# Altium schematic sheet MCU_Display.SchDoc: Microcontroller and OLED display
size A4; Date: Not used; ApprovedBy: Not used; CheckedBy: Not used; Author: Not used; CompanyName: STMicroelectronics; DrawnBy: Not used; Engineer: Not used; Organization: Not used; Address1: Not used; Address2: Not used; Address3: Not used; Address4: Not used; DocumentNumber: Not used; Revision: Not used; SheetNumber: 3; SheetTotal: 8; CurrentTime: Not used; CurrentDate: Not used; Time: Not used; DocumentFullPathAndName: Not used; DocumentName: Not used; ModifiedDate: Not used; ImagePath: Not used; ProjectName: Not used; Application_BuildNumber: Not used
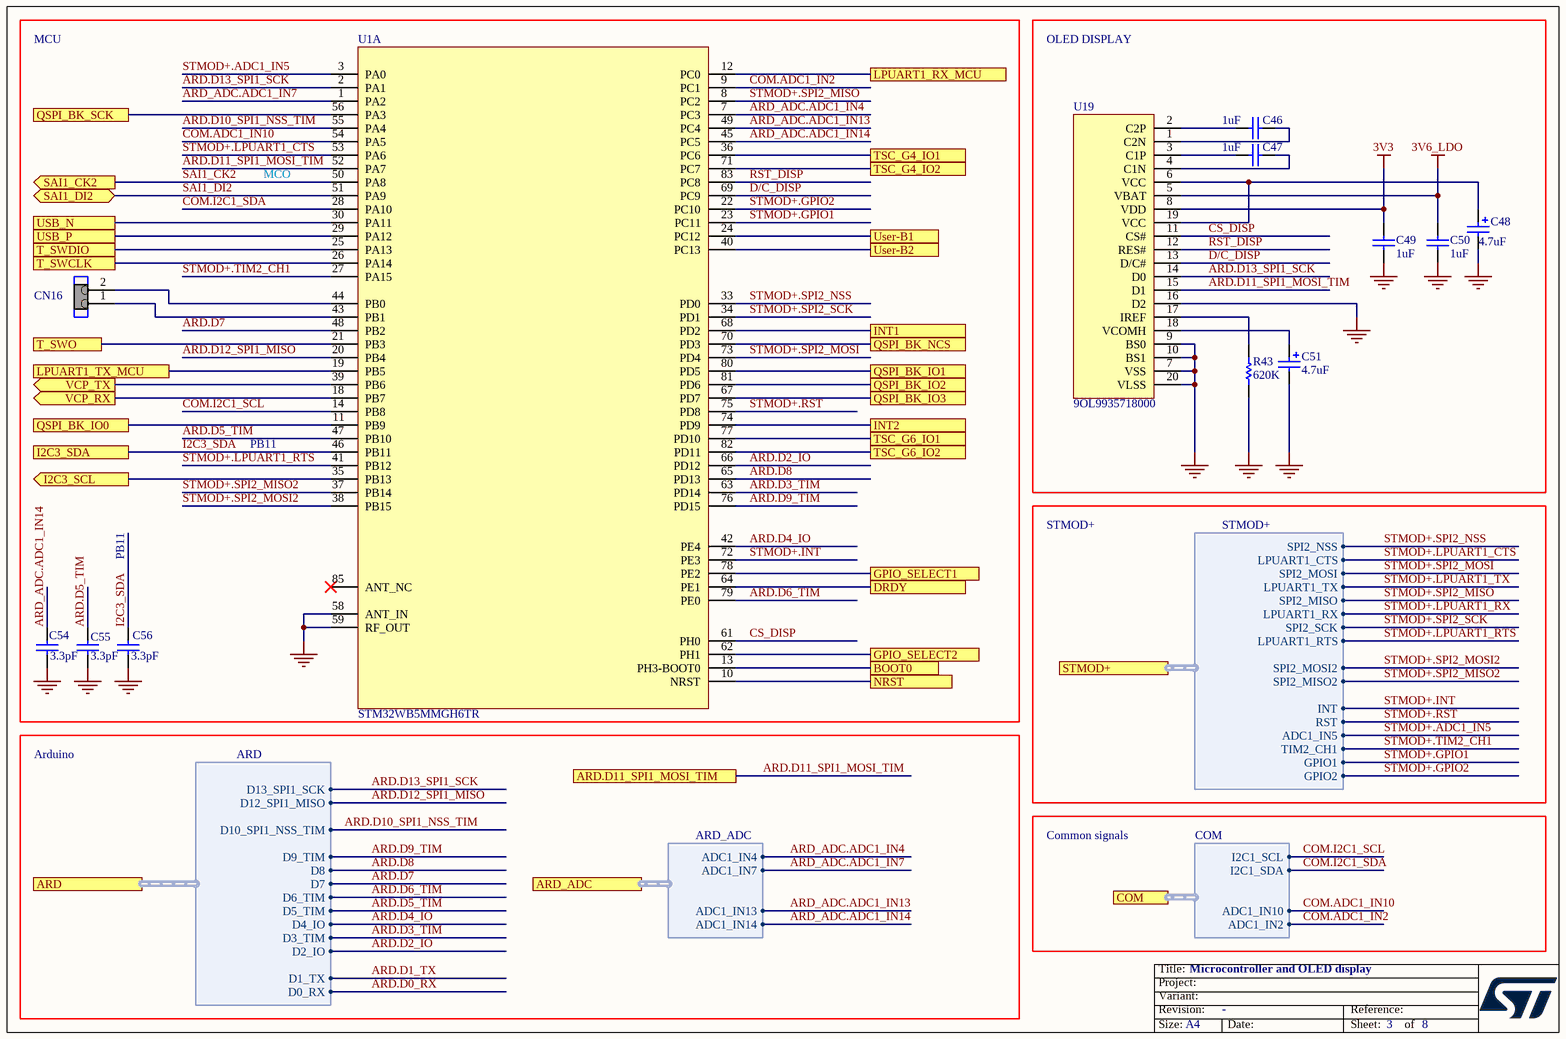
[diagram p0: MCU_Display.SchDoc]

## Parts
C46  value 1uF  [C0603]  (hidden comment: Capacitor)
C47  value 1uF  [C0603]  (hidden comment: Capacitor)
C48  value 4.7uF  [CPOL_TAJ-A_1206_H180]  (hidden comment: Cap_POL_TANA)
C49  value 1uF  [C0603]  (hidden comment: Capacitor)
C50  value 1uF  [C0603]  (hidden comment: Capacitor)
C51  value 4.7uF  [CPOL_TAJ-A_1206_H180]  (hidden comment: Cap_POL_TANA)
C54  value 3.3pF  [C0201_H0P3]  (hidden comment: Capacitor)
C55  value 3.3pF  [C0201_H0P3]  (hidden comment: Capacitor)
C56  value 3.3pF  [C0201_H0P3]  (hidden comment: Capacitor)
CN16  Jumper_Header1.27 2x1 Fitted  [CON_WP_707-2-02-2-20-00]  (value not drawn)
R43  value 620K  [R0603]  (hidden comment: Resistor)
U1  STM32WB5MMGH6TR  [MOD_DORY_STM_86P_7P3X11_H1P342]  (part A of 2)
U19  value 9OL9935718000  [OLED_RITDISPLAY_9OL9935718000]  (hidden comment: OLED_RITDISPLAY_9OL9935718000)

## Blocks framed on the sheet
OLED DISPLAY: C46-C51 R43 U19

## Ports
ARD (harness ARD), ARD.D11_SPI1_MOSI_TIM, ARD_ADC (harness ARD_ADC), BOOT0, COM (harness COM), DRDY, GPIO_SELECT1, GPIO_SELECT2, I2C3_SCL (out), I2C3_SDA, INT1, INT2, LPUART1_RX_MCU, LPUART1_TX_MCU, NRST, QSPI_BK_IO0, QSPI_BK_IO1, QSPI_BK_IO2, QSPI_BK_IO3, QSPI_BK_NCS, QSPI_BK_SCK, SAI1_CK2 (out), SAI1_DI2 (bidir), STMOD+ (harness STMOD+), T_SWCLK, T_SWDIO, T_SWO, TSC_G4_IO1, TSC_G4_IO2, TSC_G6_IO1, TSC_G6_IO2, USB_N, USB_P, User-B1, User-B2, VCP_RX (out), VCP_TX (out)

## Harnesses
STMOD+: SPI2_NSS, LPUART1_CTS, SPI2_MOSI, LPUART1_TX, SPI2_MISO, SPI2_SCK, LPUART1_RX, LPUART1_RTS, SPI2_MOSI2, SPI2_MISO2, INT, RST, ADC1_IN5, TIM2_CH1, GPIO1, GPIO2
ARD: D0_RX, D1_TX, D2_IO, D3_TIM, D4_IO, D5_TIM, D6_TIM, D7, D8, D9_TIM, D10_SPI1_NSS_TIM, D12_SPI1_MISO, D13_SPI1_SCK
ARD_ADC: ADC1_IN4, ADC1_IN7, ADC1_IN13, ADC1_IN14
COM: I2C1_SCL, I2C1_SDA, ADC1_IN10, ADC1_IN2

## Nets
3V3: C49.1 U19.8(VDD)
3V6_LDO: C50.1 U19.5(VBAT)
GND: C48.2 C49.2 C50.2 C51.2 C54.2 C55.1 C56.1 R43.1 U1.58(ANT_IN) U1.59(RF_OUT) U19.7(VSS) U19.9(BS0) U19.10(BS1) U19.16(D2) U19.20(VLSS)
ARD.D0_RX: port ARD.D0_RX
ARD.D1_TX: port ARD.D1_TX
ARD.D2_IO: U1.66(PD12) ; port ARD.D2_IO
ARD.D3_TIM: U1.63(PD14) ; port ARD.D3_TIM
ARD.D4_IO: U1.42(PE4) ; port ARD.D4_IO
ARD.D5_TIM: C55.2 U1.47(PB10) ; port ARD.D5_TIM
ARD.D6_TIM: U1.79(PE0) ; port ARD.D6_TIM
ARD.D7: U1.48(PB2) ; port ARD.D7
ARD.D8: U1.65(PD13) ; port ARD.D8
ARD.D9_TIM: U1.76(PD15) ; port ARD.D9_TIM
ARD.D10_SPI1_NSS_TIM: U1.55(PA4) ; port ARD.D10_SPI1_NSS_TIM
ARD.D11_SPI1_MOSI_TIM: U1.52(PA7) U19.15(D1) ; port ARD.D11_SPI1_MOSI_TIM
ARD.D12_SPI1_MISO: U1.20(PB4) ; port ARD.D12_SPI1_MISO
ARD.D13_SPI1_SCK: U1.2(PA1) U19.14(D0) ; port ARD.D13_SPI1_SCK
ARD_ADC.ADC1_IN4: U1.7(PC3) ; port ARD_ADC.ADC1_IN4
ARD_ADC.ADC1_IN7: U1.1(PA2) ; port ARD_ADC.ADC1_IN7
ARD_ADC.ADC1_IN13: U1.49(PC4) ; port ARD_ADC.ADC1_IN13
ARD_ADC.ADC1_IN14: C54.1 U1.45(PC5) ; port ARD_ADC.ADC1_IN14
BOOT0: U1.13(PH3-BOOT0) ; port BOOT0
COM.ADC1_IN2: U1.9(PC1) ; port COM.ADC1_IN2
COM.ADC1_IN10: U1.54(PA5) ; port COM.ADC1_IN10
COM.I2C1_SCL: U1.14(PB8) ; port COM.I2C1_SCL
COM.I2C1_SDA: U1.28(PA10) ; port COM.I2C1_SDA
CS_DISP: U1.61(PH0) U19.11(CS#)
D/C_DISP: U1.69(PC9) U19.13(D/C#)
DRDY: U1.64(PE1) ; port DRDY
GPIO_SELECT1: U1.78(PE2) ; port GPIO_SELECT1
GPIO_SELECT2: U1.62(PH1) ; port GPIO_SELECT2
I2C3_SCL: U1.35(PB13) ; port I2C3_SCL
I2C3_SDA: C56.2 U1.46(PB11) ; port I2C3_SDA
INT1: U1.68(PD2) ; port INT1
INT2: U1.74(PD9) ; port INT2
LPUART1_RX_MCU: U1.12(PC0) ; port LPUART1_RX_MCU
LPUART1_TX_MCU: U1.19(PB5) ; port LPUART1_TX_MCU
NRST: U1.10(NRST) ; port NRST
QSPI_BK_IO0: U1.11(PB9) ; port QSPI_BK_IO0
QSPI_BK_IO1: U1.80(PD5) ; port QSPI_BK_IO1
QSPI_BK_IO2: U1.81(PD6) ; port QSPI_BK_IO2
QSPI_BK_IO3: U1.67(PD7) ; port QSPI_BK_IO3
QSPI_BK_NCS: U1.70(PD3) ; port QSPI_BK_NCS
QSPI_BK_SCK: U1.56(PA3) ; port QSPI_BK_SCK
RST_DISP: U1.83(PC8) U19.12(RES#)
SAI1_CK2: U1.50(PA8) ; port SAI1_CK2
SAI1_DI2: U1.51(PA9) ; port SAI1_DI2
STMOD+.ADC1_IN5: U1.3(PA0) ; port STMOD+.ADC1_IN5
STMOD+.GPIO1: U1.23(PC11) ; port STMOD+.GPIO1
STMOD+.GPIO2: U1.22(PC10) ; port STMOD+.GPIO2
STMOD+.INT: U1.72(PE3) ; port STMOD+.INT
STMOD+.LPUART1_CTS: U1.53(PA6) ; port STMOD+.LPUART1_CTS
STMOD+.LPUART1_RTS: U1.41(PB12) ; port STMOD+.LPUART1_RTS
STMOD+.LPUART1_RX: port STMOD+.LPUART1_RX
STMOD+.LPUART1_TX: port STMOD+.LPUART1_TX
STMOD+.RST: U1.75(PD8) ; port STMOD+.RST
STMOD+.SPI2_MISO: U1.8(PC2) ; port STMOD+.SPI2_MISO
STMOD+.SPI2_MISO2: U1.37(PB14) ; port STMOD+.SPI2_MISO2
STMOD+.SPI2_MOSI: U1.73(PD4) ; port STMOD+.SPI2_MOSI
STMOD+.SPI2_MOSI2: U1.38(PB15) ; port STMOD+.SPI2_MOSI2
STMOD+.SPI2_NSS: U1.33(PD0) ; port STMOD+.SPI2_NSS
STMOD+.SPI2_SCK: U1.34(PD1) ; port STMOD+.SPI2_SCK
STMOD+.TIM2_CH1: U1.27(PA15) ; port STMOD+.TIM2_CH1
T_SWCLK: U1.26(PA14) ; port T_SWCLK
T_SWDIO: U1.25(PA13) ; port T_SWDIO
T_SWO: U1.21(PB3) ; port T_SWO
TSC_G4_IO1: U1.36(PC6) ; port TSC_G4_IO1
TSC_G4_IO2: U1.71(PC7) ; port TSC_G4_IO2
TSC_G6_IO1: U1.77(PD10) ; port TSC_G6_IO1
TSC_G6_IO2: U1.82(PD11) ; port TSC_G6_IO2
USB_N: U1.30(PA11) ; port USB_N
USB_P: U1.29(PA12) ; port USB_P
User-B1: U1.24(PC12) ; port User-B1
User-B2: U1.40(PC13) ; port User-B2
VCP_RX: U1.18(PB7) ; port VCP_RX
VCP_TX: U1.39(PB6) ; port VCP_TX
NetC46_1: C46.1 U19.2(C2P)
NetC46_2: C46.2 U19.1(C2N)
NetC47_1: C47.1 U19.3(C1P)
NetC47_2: C47.2 U19.4(C1N)
NetC48_1: C48.1 U19.6(VCC) U19.19(VCC)
NetC51_1: C51.1 U19.18(VCOMH)
NetCN16_1: CN16.1 U1.43(PB1)
NetCN16_2: CN16.2 U1.44(PB0)
NetR43_2: R43.2 U19.17(IREF)

Not connected (* = marked no-connect by the designer): U1 85(ANT_NC)*

## Notes on the sheet
- MCU
- MCO
- PB11
- STMOD+
- Arduino
- Common signals
- Title:
- Project:
- Size:
- Revision:
- Variant:
- A4
- -
- Date:
- Reference:
- Sheet:
- of

## Library data of the parts
C46 C47 C49 C50 = MCD-00010: Capacitor, MLCC, 1uF, 16V, X5R, +/-10%, 0603, T=0,8mm; Manufacturer_Part_Number: CC0603KRX5R7BB105; Manufacturer: YAGEO; Part_Preference: Recommended; Internal_Part_Number: MCD-00010; Status: Released; Part_Type: Capacitor; Package: C0603; ComponentLink1URL: http://tunmcdsvn.tun.st.com/Component_Datasheet_Library/Trunk/Capacitors/Yageo_Multilayer_capacitor_X5R_series_100pF_to_100uF; Order_Code_Digikey: 311-1444-1-ND; Order_Code_Farnell: 2370680; Order_Code_RS: N/A
C48 C51 = MCD-01043: Capacitor, Tantalum, 4.7uF, 25V, 5.5ohms, 10%,pkg Type_A (3216 metric), T=1.6mm; Manufacturer_Part_Number: 293D475X9025A2TE3; Manufacturer: VISHAY; Part_Preference: Recommended; Order_Code_RS: 179-7472; Revision: July-2002: Re-released for DXP Platform.; Internal_Part_Number: MCD-01043; Status: Checked; Part_Type: Capacitor; Package: Type_A; ComponentLink1URL: http://tunmcdsvn.tun.st.com/Component_Datasheet_Library/Trunk/Capacitors/VISHAY_CAPACITOR_TANTALUM_293D; Order_Code_Farnell: 2666694; Alternate_Manufacturer: N/A; Alternate_Manufacturer_Part_Number: N/A; Order_Code_Digikey: N/A
C54-C56 = MCD-02284: Capacitor, MLCC, 3.3pF, 50V, NPO, +-0.05pF, 0201, T=0.3mm".; Part_Preference: Recommended; Manufacturer: MURATA; Manufacturer_Part_Number: GRM0335C2A3R3WA01J; Internal_Part_Number: MCD-02284; Status: Checked; Part_Type: Capacitor; Alternate_Manufacturer: N/A; Alternate_Manufacturer_Part_Number: N/A; Package: C0201; ComponentLink1URL: http://tunmcdsvn.tun.st.com/Component_Datasheet_Library/Trunk/Capacitors/MURATA_Capacitor_GRM_series/MURATA_GRM_Datasheet.pdf; Order_Code_Digikey: N/A; Order_Code_Farnell: N/A; Order_Code_RS: N/A
CN16 = MCD-01428: Header, 2x1, 1.27mm, RA, TH, T=3.05mm/1.27mm; Part_Type: Connector; Part_Preference: Recommended; Manufacturer: W&P PRODUCTS; Manufacturer_Part_Number: 707-2-02-2-20-00; Value: Header 2x1; Component_Country_Of_Origin: China; ShowFields: YES; ID: 3528; Internal_Part_Number: MCD-01428; Status: Checked; ComponentLink1URL: http://tunmcdsvn.tun.st.com/Component_Documentation_Library/Trunk/Connector/W&P_PRODUCTS_707_Series/; Order_Code_Digikey: N/A; Order_Code_Farnell: N/A; Order_Code_RS: N/A
R43 = MCD-00506: Resistor,620K,0603,1%,1/10W; Manufacturer_Part_Number: RC0603FR-07620KL; Manufacturer: YAGEO; Part_Preference: Recommended; Internal_Part_Number: MCD-00506; Status: Released; Part_Type: Resistor; Package: R0603; ComponentLink1URL: http://tunmcdsvn.tun.st.com/Component_Datasheet_Library/Trunk/Resistors/Yageo_Resistor_RC0603-series; Order_Code_Digikey: 311-620KHRCT-ND; Order_Code_Farnell: N/A; Order_Code_RS: N/A
U1 = MCD-01965: STM32 BLE module based on STM32WB55; Part_Type: Misc; Manufacturer: STMICROELECTRONICS; Part_Preference: Recommended; Manufacturer_HQ_COO: EU; Component_Country_Of_Origin: Taiwan; Value: STM32WB5MMGH6TR; Order_Code_Digikey: N/A; Order_Code_Farnell: N/A; Order_Code_RS: N/A; Status: Checked; ComponentLink1URL: http://tunmcdsvn.tun.st.com/Component_Datasheet_Library/Trunk/Misc/STM_STM32WBxxx_dory_module; Internal_Part_Number: MCD-01965; Manufacturer_Part_Number: STM32WB5MMGH6TR; Alternate_Manufacturer_Part_Number: N/A; Alternate_Manufacturer: N/A
U19 = MCD-01925: 128*64 Dots 20-pin OLED display; Alternate_Manufacturer_Part_Number: 9OL9935701000; Part_Preference: Recommended; Internal_Part_Number: MCD-01925; Status: Released; Part_Type: Display; Manufacturer_Part_Number: 9OL9935718000; Manufacturer: RITDISPLAY; Alternate_Manufacturer: RITDISPLAY; Package: SMT; ComponentLink1URL: http://tunmcdsvn.tun.st.com/Component_Datasheet_Library/Trunk/Display/RiTDisplay_128x64_OLED_white_9OL9935718000; Order_Code_Digikey: N/A; Order_Code_Farnell: N/A; Order_Code_RS: N/A